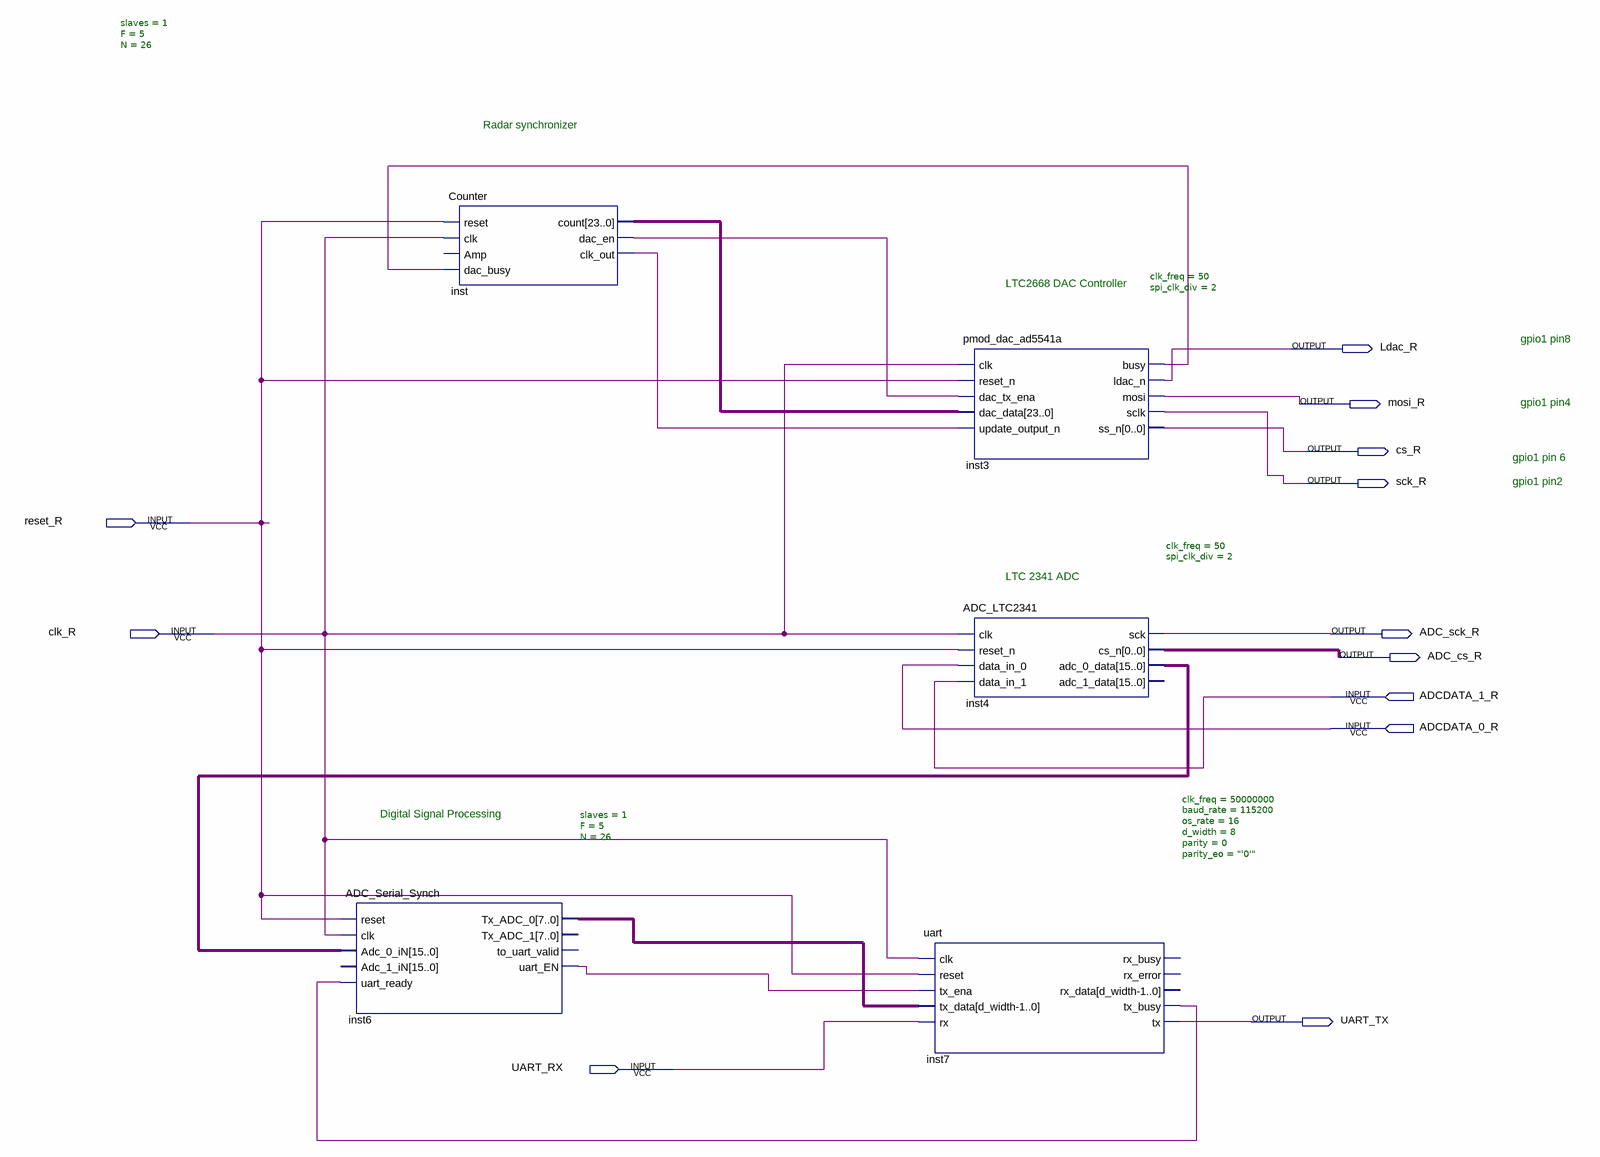
[diagram p0: schematic sheet]
// Quartus schematic Eslam_First_Fpga.bdf as structural Verilog: 5 symbols, 12 pins
module Eslam_First_Fpga (
  input  reset_R,
  input  clk_R,
  input  ADCDATA_1_R,
  input  ADCDATA_0_R,
  input  UART_RX,
  output Ldac_R,
  output mosi_R,
  output cs_R,
  output sck_R,
  output ADC_sck_R,
  output ADC_cs_R,
  output UART_TX
);

  wire inst3_busy, inst6_uart_en, inst7_tx_busy, inst_clk_out, inst_dac_en;
  wire [7:0] inst6_tx_adc_0;
  wire [15:0] inst4_adc_0_data;
  wire [23:0] inst_count;

  ADC_Serial_Synch #(.slaves(1), .F(5), .N(26)) inst6 (
    .reset(reset_R), .clk(clk_R), .Adc_0_iN(inst4_adc_0_data), .uart_ready(inst7_tx_busy),
    .uart_EN(inst6_uart_en), .Tx_ADC_0(inst6_tx_adc_0));  // open: Adc_1_iN, to_uart_valid, Tx_ADC_1
  Counter #(.slaves(1), .F(5), .N(26)) inst (
    .reset(reset_R), .clk(clk_R), .dac_busy(inst3_busy), .count(inst_count), .dac_en(inst_dac_en),
    .clk_out(inst_clk_out));  // open: Amp
  uart #(.clk_freq(50000000), .baud_rate(115200), .os_rate(16), .d_width(8), .parity(0), .parity_eo("'0'")) inst7 (
    .clk(clk_R), .reset(reset_R), .tx_ena(inst6_uart_en), .tx_data(inst6_tx_adc_0), .rx(UART_RX),
    .tx_busy(inst7_tx_busy), .tx(UART_TX));  // open: rx_busy, rx_error, rx_data
  pmod_dac_ad5541a #(.clk_freq(50), .spi_clk_div(2)) inst3 (
    .clk(clk_R), .reset_n(reset_R), .dac_tx_ena(inst_dac_en), .dac_data(inst_count),
    .update_output_n(inst_clk_out), .busy(inst3_busy), .ldac_n(Ldac_R), .mosi(mosi_R), .sclk(sck_R),
    .ss_n(cs_R));
  ADC_LTC2341 #(.clk_freq(50), .spi_clk_div(2)) inst4 (
    .clk(clk_R), .reset_n(reset_R), .data_in_0(ADCDATA_0_R), .data_in_1(ADCDATA_1_R), .sck(ADC_sck_R),
    .cs_n(ADC_cs_R), .adc_0_data(inst4_adc_0_data));  // open: adc_1_data

  // Notes on the sheet:
  //   Radar synchronizer
  //   LTC2668 DAC Controller
  //   gpio1 pin8
  //   gpio1 pin4
  //   gpio1 pin 6
  //   gpio1 pin2
  //   LTC 2341 ADC
  //   Digital Signal Processing 
endmodule
